# Altium schematic sheet eVV_Driver TMC5130.SchDoc: eVV_Driver TMC5130
size A4; DrawnBy: Ivica Matovic; Revision: 1.1; SheetNumber: 7; SheetTotal: 8
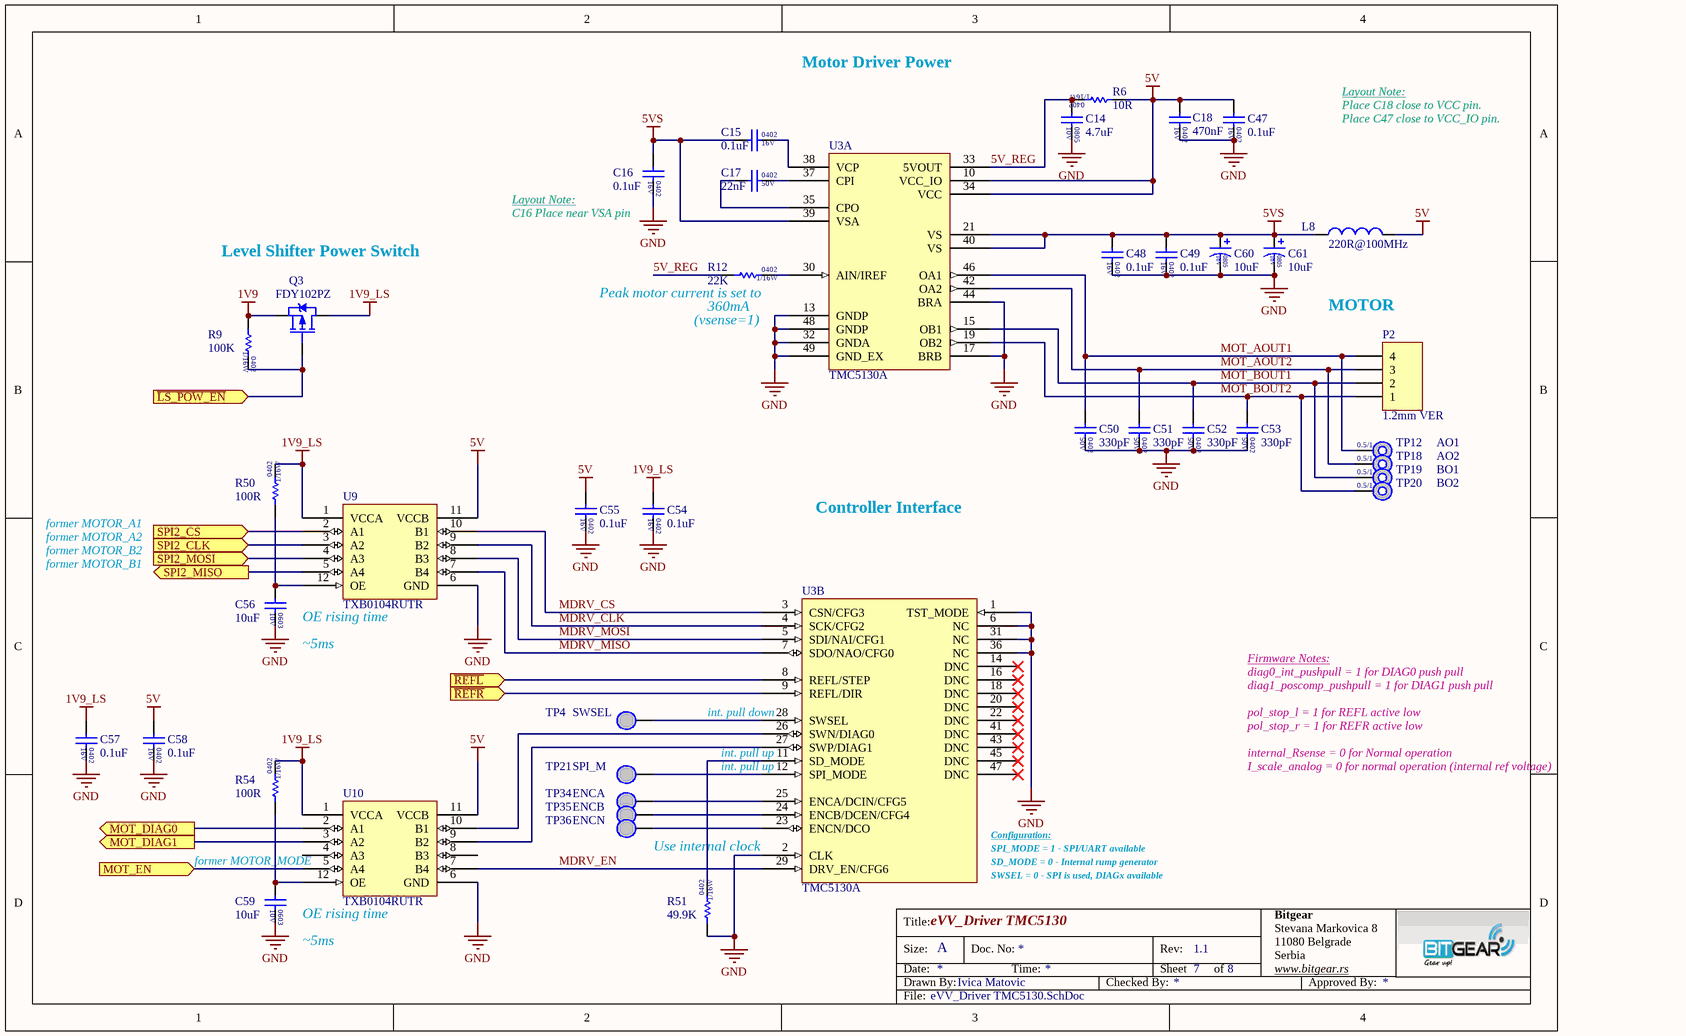
[diagram p0: eVV_Driver TMC5130.SchDoc]

## Parts
C14  4.7uF  [CAPC2012X145N]
C15  0.1uF  [CAPC1005X60N]
C16  0.1uF  [CAPC1005X60N]
C17  22nF  [CAPC1005X60N]
C18  470nF  [CAPC1005X60N]
C47  0.1uF  [CAPC1005X60N]
C48  0.1uF  [CAPC1005X60N]
C49  0.1uF  [CAPC1005X60N]
C50  330pF  [CAPC1005X60N]
C51  330pF  [CAPC1005X60N]
C52  330pF  [CAPC1005X60N]
C53  330pF  [CAPC1005X60N]
C54  0.1uF  [CAPC1005X60N]
C55  0.1uF  [CAPC1005X60N]
C56  10uF  [CAPC1608X95N]
C57  0.1uF  [CAPC1005X60N]
C58  0.1uF  [CAPC1005X60N]
C59  10uF  [CAPC1608X95N]
C60  10uF  [CAPMP2012X120N]
C61  10uF  [CAPMP2012X120N]
L8  220R@100MHz  [INDC1005X60N]
P2  1.2mm VER  [MOLEX_0781710004]
Q3  FDY102PZ  [SOT50P160X78-3N]
R6  10R  [RESC1005X40AN]
R9  100K  [RESC1005X40AN]
R12  22K  [RESC1005X40AN]
R50  100R  [RESC1005X40AN]
R51  49.9K  [RESC1005X40AN]
R54  100R  [RESC1005X40AN]
TP4  SWSEL  [TEST_POINT_1MM]  (no BOM)
TP12  AO1  [TEST_POINT_TH_1MM]  (no BOM)
TP18  AO2  [TEST_POINT_TH_1MM]  (no BOM)
TP19  BO1  [TEST_POINT_TH_1MM]  (no BOM)
TP20  BO2  [TEST_POINT_TH_1MM]  (no BOM)
TP21  SPI_M  [TEST_POINT_1MM]  (no BOM)
TP34  ENCA  [TEST_POINT_1MM]  (no BOM)
TP35  ENCB  [TEST_POINT_1MM]  (no BOM)
TP36  ENCN  [TEST_POINT_1MM]  (no BOM)
U3  TMC5130A  [QFP50P900X900X120-48N-TP]  (parts A,B of 2)
U9  TXB0104RUTR  [RUT40P170X200X55-12N]
U10  TXB0104RUTR  [RUT40P170X200X55-12N]

## Ports
MOT_DIAG0 (out), MOT_DIAG1 (out), MOT_EN (in), SPI2_CLK (in), SPI2_CS (in), SPI2_MISO (out), SPI2_MOSI (in), ~{LS_POW_EN} (in), ~{REFL} (in), ~{REFR} (in)

## Nets
1V9: Q3.2(S) R9.2
1V9_LS: C54.1 C57.1 Q3.3(D) R50.1 R54.1 U9.1(VCCA) U10.1(VCCA)
5V: C18.1 C47.1 C55.1 C58.1 L8.2 R6.2 U3.10(VCC_IO) U3.34(VCC) U9.11(VCCB) U10.11(VCCB)
5VS: C15.1 C16.1 C48.1 C49.1 C60.1 C61.1 L8.1 U3.21(VS) U3.39(VSA) U3.40(VS)
GND: C14.2 C16.2 C18.2 C47.2 C48.2 C49.2 C50.2 C51.2 C52.2 C53.2 C54.2 C55.2 C56.2 C57.2 C58.2 C59.2 C60.2 C61.2 R51.2 U3.1(TST_MODE) U3.2(CLK) U3.6(NC) U3.13(GNDP) U3.17(BRB) U3.31(NC) U3.32(GNDA) U3.36(NC) U3.44(BRA) U3.48(GNDP) U3.49(GND_EX) U9.6(GND) U10.6(GND)
5V_REG: C14.1 R6.1 R12.2 U3.33(5VOUT)
~{LS_POW_EN}: Q3.1(G) R9.1 ; port ~{LS_POW_EN}
~{REFL}: U3.8(REFL/STEP) ; port ~{REFL}
~{REFR}: U3.9(REFL/DIR) ; port ~{REFR}
MDRV_CLK: U3.4(SCK/CFG2) U9.9(B2)
MDRV_CS: U3.3(CSN/CFG3) U9.10(B1)
MDRV_EN: U3.29(DRV_EN/CFG6) U10.7(B4)
MDRV_MISO: U3.7(SDO/NAO/CFG0) U9.7(B4)
MDRV_MOSI: U3.5(SDI/NAI/CFG1) U9.8(B3)
MOT_AOUT1: C50.1 P2.4 TP12.1 U3.46(OA1)
MOT_AOUT2: C51.1 P2.3 TP18.1 U3.42(OA2)
MOT_BOUT1: C52.1 P2.2 TP19.1 U3.15(OB1)
MOT_BOUT2: C53.1 P2.1 TP20.1 U3.19(OB2)
MOT_DIAG0: U10.2(A1) ; port MOT_DIAG0
MOT_DIAG1: U10.3(A2) ; port MOT_DIAG1
MOT_EN: U10.5(A4) ; port MOT_EN
SPI2_CLK: U9.3(A2) ; port SPI2_CLK
SPI2_CS: U9.2(A1) ; port SPI2_CS
SPI2_MISO: U9.5(A4) ; port SPI2_MISO
SPI2_MOSI: U9.4(A3) ; port SPI2_MOSI
NetC15_2: C15.2 U3.38(VCP)
NetC17_1: C17.1 U3.35(CPO)
NetC17_2: C17.2 U3.37(CPI)
NetC56_1: C56.1 R50.2 U9.12(OE)
NetC59_1: C59.1 R54.2 U10.12(OE)
NetR12_1: R12.1 U3.30(AIN/IREF)
NetR51_1: R51.1 U3.11(SD_MODE)
NetTP4_1: TP4.1 U3.28(SWSEL)
NetTP21_1: TP21.1 U3.12(SPI_MODE)
NetTP34_1: TP34.1 U3.25(ENCA/DCIN/CFG5)
NetTP35_1: TP35.1 U3.24(ENCB/DCEN/CFG4)
NetTP36_1: TP36.1 U3.23(ENCN/DCO)
NetU3_26: U3.26(SWN/DIAG0) U10.10(B1)
NetU3_27: U3.27(SWP/DIAG1) U10.9(B2)

Not connected (* = marked no-connect by the designer): U3 14(DNC)* 16(DNC)* 18(DNC)* 20(DNC)* 22(DNC)* 41(DNC)* 43(DNC)* 45(DNC)* 47(DNC)*; U10 4(A3) 8(B3)

## Notes on the sheet
- Motor Driver Power
- Layout Note:
- Place C18 close to VCC pin.
- Place C47 close to VCC_IO pin.
- (near C16) C16 Place near VSA pin
- Level Shifter Power Switch
- (near R12) Peak motor current is set to
- (near R12) 360mA
- MOTOR
- (near R12) (vsense=1)
- Due to electrical operating recommendations, driver must be used in 5V Only Supply mode. Page 112 in data sheet.
- Controller Interface
- former MOTOR_B2
- former MOTOR_B1
- former MOTOR_A2
- former MOTOR_A1
- OE rising time
- ~5ms
- (near U3) int. pull down
- Firmware Notes:
- diag0_int_pushpull = 1 for DIAG0 push pull
- diag1_poscomp_pushpull = 1 for DIAG1 push pull
- pol_stop_l = 1 for REFL active low
- (near U3) int. pull up
- pol_stop_r = 1 for REFR active low
- internal_Rsense = 0 for Normal operation
- I_scale_analog = 0 for normal operation (internal ref voltage)
- Use internal clock
- (near U3) Configuration:
- (near U3) SPI_MODE = 1 - SPI/UART available
- (near C59) former MOTOR_MODE
- (near U3) SD_MODE = 0 - Internal rump generator
- (near U3) SWSEL = 0 - SPI is used, DIAGx available
- Title:
- Bitgear
- Size:
- Date:
- Drawn By:
- A
- Doc. No:
- Time:
- Checked By:
- Sheet
- Rev:
- of
- Stevana Markovica 8
- 11080 Belgrade
- Serbia
- www.bitgear.rs
- Approved By:
- File:
- (in symbol Cap-1005 (0402) CER 0.1UF 16V X7R 10%) 16V
- (in symbol Cap-1005 (0402) CER 22nF 50V X7R 10%) 0402; 50V
- (in symbol Cap-1005 (0402) CER 330pF 50V C0G 5%) 50V
- (in symbol Cap-1005 (0402) Cer 470nF 16V X5R 10%) 16V
- (in symbol Cap-1608 (0603) CER 10uF 10V X5R 20%) 10V
- (in symbol Cap-2012 (0805) CER 4.7uF 10V X5R 10%) 10V
- (in symbol Cap-2012 (0805) TAN 10uF 16V 20%) 16V; 0805
- (in symbol Res-1005 (0402) 10 Ohm 1/16W 1%) 1/16W; 0402
- (in symbol Res-1005 (0402) 22 KOhm 1/16W 1%) 0402; 1/16W
- (in symbol Res-1005 (0402) 49.9 KOhm 1/16W 1%) 0402; 1/16W
- (in symbol Res-1005 (0402) 100 KOhm 1/16W 1%) 1/16W; 0402
- (in symbol Res-1005 (0402) 100 Ohm 1/16W 1%) 0402; 1/16W
- (in symbol TP TH) 0.5/1

## Library data of the parts
C14 = Cap-2012 (0805) CER 4.7uF 10V X5R 10%: Capacitor Ceramic 4.7uF 2012 (0805) 10V X5R 10%; Manufacturer: Samsung Electro-Mechanics America; D P/N: 1276-1259-1-ND; D Price: 0.14; M P/N: CL21A475KPFNNNE; S MOQ: 2000; S P/N: 1276-1259-2-ND; S Price: 0.02256; Distributor: Digikey; Mounting: SM; Supplier: Digi Key; Package: 0805; Value: 4.7uF
C15 C16 C47-C49 C54 C55 C57 C58 = Cap-1005 (0402) CER 0.1UF 16V X7R 10%: CAP CER 0.1UF 0402 (1005) 16V X7R 10%; Manufacturer: Murata Electronics North America; D P/N: 490-3261-1-ND; D Price: 0.1; M P/N: GRM155R71C104KA88D; S MOQ: 10000; S P/N: 490-3261-2-ND; S Price: 0.00462; Distributor: Digikey; Mounting: SMD; Supplier: Digi Key; Package: 0402; Value: 0.1uF
C17 = Cap-1005 (0402) CER 22nF 50V X7R 10%: Manufacturer: Murata Electronics North America; M P/N: GRM155R71H223KA12J; D P/N: 490-6360-1-ND; D Price: 0.1; S MOQ: 1000; S Price: 0.01; Distributor: Digi Key; Mounting: SM; S P/N: 490-6360-1-ND; Value: 22nF; Supplier: Digi Key
C18 = Cap-1005 (0402) Cer 470nF 16V X5R 10%: CAP Cer 470nF 0402 (1005) 16V X5R 10%; Manufacturer: TDK; D P/N: 445-4976-1-ND; D Price: 0.12; M P/N: C1005X5R1C474K050BC; S MOQ: 1000; S Price: 0.022; Distributor: Digikey; Mounting: SMD; S P/N: 445-4976-1-ND; Supplier: Digi Key; Package: 0402; Value: 470nF
C50-C53 = Cap-1005 (0402) CER 330pF 50V C0G 5%: Manufacturer: Murata Electronics North America; D P/N: 490-8200-1-ND; D Price: 0.1; M P/N: GRM1555C1H331JA01J; S MOQ: 1000; S Price: 0.0174; Distributor: Digikey; Mounting: SMD; S P/N: 490-8200-1-ND; Supplier: Digi Key; Package: 0402; Value: 330pF
C56 C59 = Cap-1608 (0603) CER 10uF 10V X5R 20%: Capacitor Ceramic 10uF 1608 (0603) 10V X5R 20%; Manufacturer: Taiyo Yuden; D P/N: 587-3412-1-ND; D Price: 0.4; M P/N: LMK107BBJ106MAHT; S MOQ: 4000; S P/N: 587-3412-2-ND; S Price: 0.08296; Distributor: Digikey; Mounting: SM; Supplier: Digi Key; Package: 0603; Value: 10uF
C60 C61 = Cap-2012 (0805) TAN 10uF 16V 20%: Manufacturer: Rohm Semiconductor; D P/N: 511-1683-1-ND; D Price: 0.86; M P/N: TCTP1C106M8R; S MOQ: 1000; S Price: 0.315; Distributor: Digikey; Mounting: SMD; S P/N: 511-1683-1-ND; Supplier: Digi Key; Package: 6.3X6.3mm; Value: 10uF
L8 = FBead-1005 (0402) 220 Ohm 800mA: FERRITE BEAD 220 Ohm 800mA 0402; Manufacturer: Taiyo Yuden; D P/N: 587-2088-1-ND; D Price: 0.1; M P/N: BKP1005HS221-T; S MOQ: 10000; S P/N: 587-2088-2-ND; S Price: 0.01503; Value: 220Ohm; Distributor: Digikey; Mounting: SM; Supplier: Digi Key
P2 = Connector MOLEX Pico-EZmate 1X4 1.2mm: 1.2mm pitch Pico-EZmate, Wire to Board, Vertical, with Locks, 1X4; Manufacturer: Molex; D P/N: WM4460CT-ND; D Price: 0.66; M P/N: 078171-0004; S MOQ: 1000; S Price: 0.34; Distributor: Digikey; Mounting: SMD; S P/N: WM4460CT-ND; Supplier: Digi Key; Value: 1X4
Q3 = FDY102PZ: P-MOSFET Single 0.83A Low Vgs; Manufacturer: Fairchild; D Price: 0.46; M P/N: FDY102PZCT-ND; S P/N: FDY102PZTR-ND; S Price: 0.08514; S MOQ: 3000; D P/N: FDY102PZ; Distributor: Digikey; Value: FDY102PZ; Mounting: SMD; Package: SC89-3; Supplier: Digi Key
R6 = Res-1005 (0402) 10 Ohm 1/16W 1%: Manufacturer: Samsung Electro-Mechanics America; D P/N: 1276-3428-1-ND; D Price: 0.1; M P/N: RC1005F100CS; S MOQ: 1000; S Price: 0.00233; Distributor: Digikey; Mounting: SM; S P/N: 1276-3428-1-ND; Supplier: Digi Key; Value: 10R
R9 = Res-1005 (0402) 100 KOhm 1/16W 1%: Manufacturer: Vishay Dale; D P/N: 311-100KLRCT-ND; D Price: 0.1; M P/N: RC0402FR-07100KL; S MOQ: 10000; S P/N: 311-100KLRTR-ND; S Price: 0.00152; Distributor: Digikey; Mounting: SM; Supplier: Digi Key; Value: 100K
R12 = Res-1005 (0402) 22 KOhm 1/16W 1%: Manufacturer: Yageo; D P/N: 311-22.0KLRCT-ND; D Price: 0.1; M P/N: RC0402FR-0722KL; S MOQ: 1000; S Price: 0.00268; Distributor: Digikey; Mounting: SM; S P/N: 311-22.0KLRCT-ND; Supplier: Digi Key; Value: 22K
R50 R54 = Res-1005 (0402) 100 Ohm 1/16W 1%: Manufacturer: Vishay Dale; D P/N: 541-100LCT-ND; D Price: 0.083; M P/N: CRCW0402100RFKED; S MOQ: 10000; S P/N: 541-100LTR-ND; S Price: 0.0054; Distributor: Digikey; Mounting: SM; Supplier: Digi Key; Value: 100R
R51 = Res-1005 (0402) 49.9 KOhm 1/16W 1%: Manufacturer: Yageo; D P/N: 311-49.9KLRCT-ND; D Price: 0.1; M P/N: RC0402FR-0749K9L; S MOQ: 10000; S P/N: 311-49.9KLRTR-ND; S Price: 0.00152; Distributor: Digikey; Mounting: SM; Supplier: Digi Key; Value: 49.9K
TP4 TP21 TP34-TP36 = TP: Test point; D P/N: TESTP; D Price: 0; M P/N: TESTP; Mounting: SM
TP12 TP18-TP20 = TP TH: Test point Through Hole; D P/N: TESTP; D Price: 0; M P/N: TESTP; Mounting: SM
U3 = TMC5130A: Universal high voltage controller/driver for two-phase bipolar stepper motor; Manufacturer: Trinamic Motion Control; M P/N: TMC5130A-TA-T; D P/N: 1460-1126-1-ND; D Price: 6.52; S MOQ: 1000; S Price: 3.26; Mounting: SMD; Distributor: Digikey; Supplier: Digi Key; S P/N: 1460-1126-1-ND
U9 U10 = TXB0104RUTR: 4-bit Bidirectional Voltage Translator; Manufacturer: Texas Instruments; D P/N: 296-25888-1-ND; D Price: 1.69; S MOQ: 1000; S Price: 0.73; Mounting: SMD; M P/N: TXB0104RUTR; Distributor: Digikey; Supplier: Digi Key; S P/N: 296-25888-1-ND